# EasyEDA schematic 1-Schematic_LED PISCA.json
TITLE: Projeto Pisca LED; REV: 1.0; Date: 2023-09-17; Sheet: 1/1; Drawn By: alunoesquematico; Company: IFSP-GRU
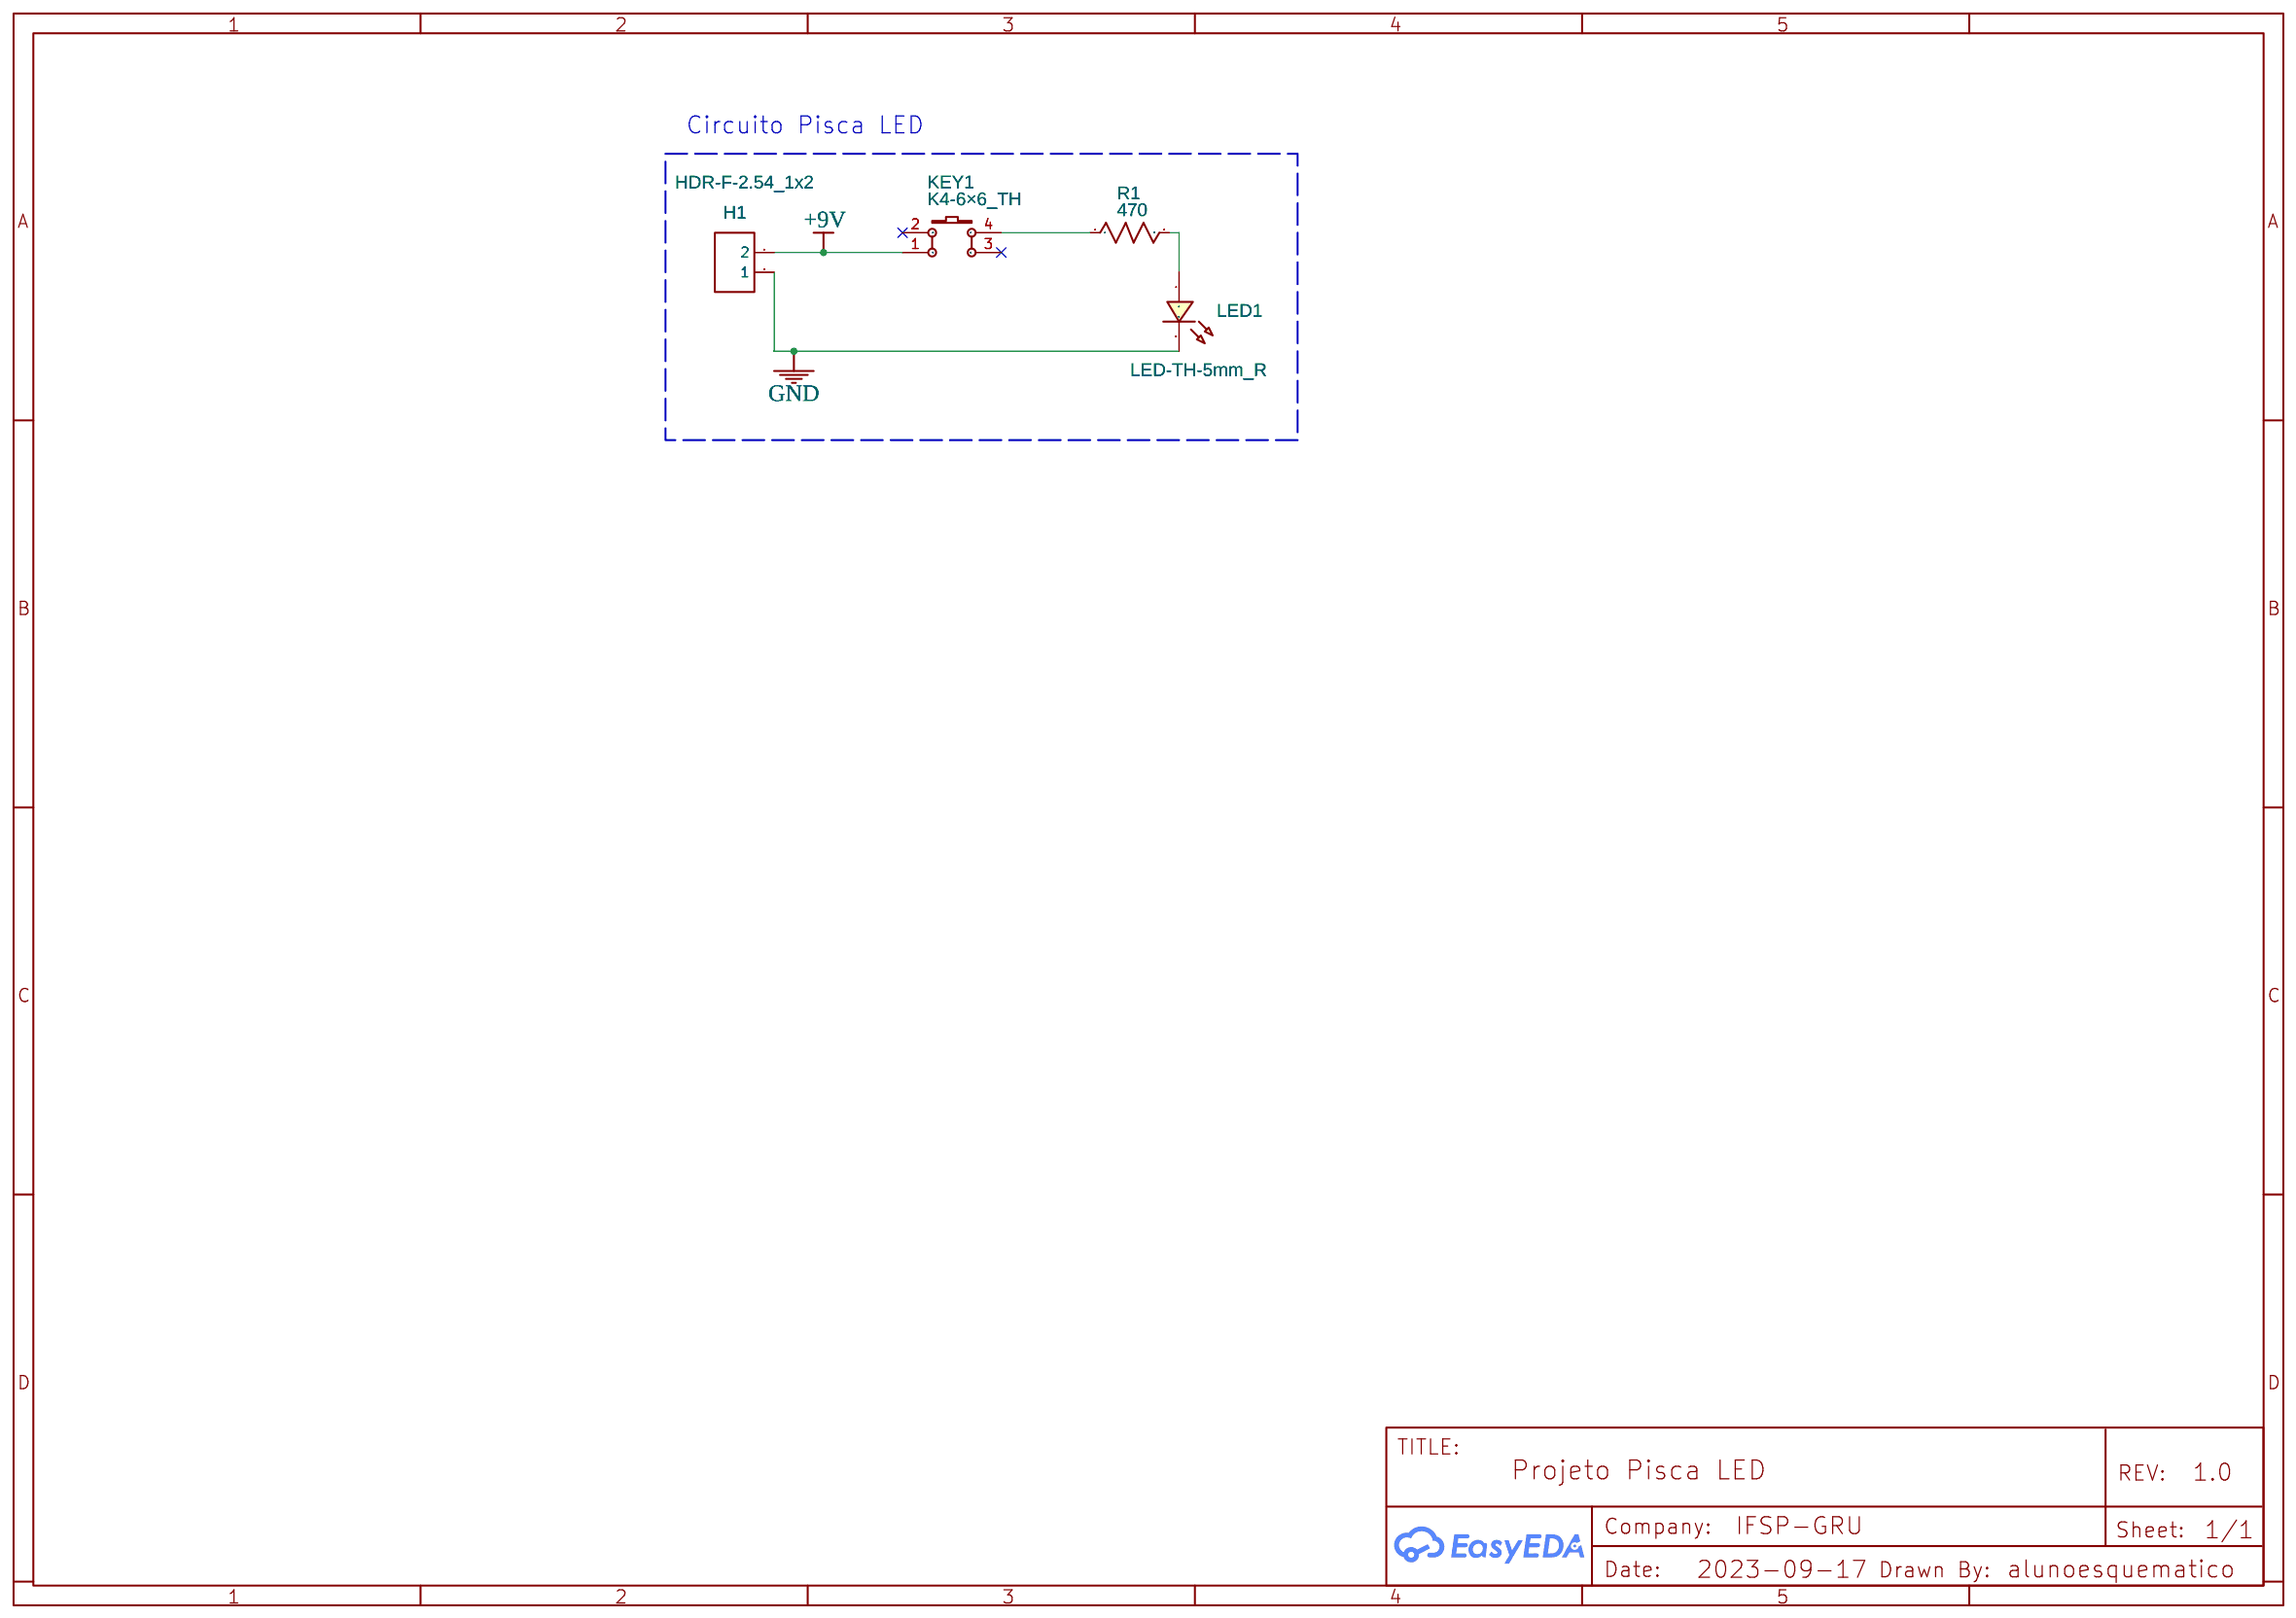
[diagram p0: schematic sheet]

## Parts
H1  HDR-F-2.54_1x2  [HDR-F-2.54_1X2]
KEY1  K4-6×6_TH  [KEY-TH_4P-L6.0-W6.0-P4.50-LS6.5]
LED1  LED-TH-5mm_R  [LED-TH_BD5.0_RED]
R1  470  [R_AXIAL-0.4]

## Library data of the parts
H1 = HDR-F-2.54_1x2: Supplier Part: C49661; Supplier: LCSC; Contributor: LCEDA_Lib
KEY1 = K4-6×6_TH: Supplier: LCSC; Supplier Part: C136684; Manufacturer: 韩国韩荣; Manufacturer Part: K2-1102DP-E4SW-04; Contributor: LCEDA_Lib
LED1 = LED-TH-5mm_R: Manufacturer: EVERLIGHT(台湾亿光); Manufacturer Part: 333-2SURD/S530-A3; Supplier Part: C87271; Supplier: LCSC; Contributor: LCEDA_Lib
R1 = R_AXIAL-0.4_US: Contributor: LCEDA_Lib

## Nets
+9V: H1.2 KEY1.1
GND: H1.1 LED1.2
Net-(KEY1-4): KEY1.4 R1.1
Net-(LED1-1): LED1.1 R1.2

Not connected (* = marked no-connect by the designer): KEY1 2* 3*

## Notes on the sheet
- Circuito Pisca LED
